# Altium schematic sheet External_boards.SchDoc
size A4; SheetNumber: 7; SheetTotal: 7
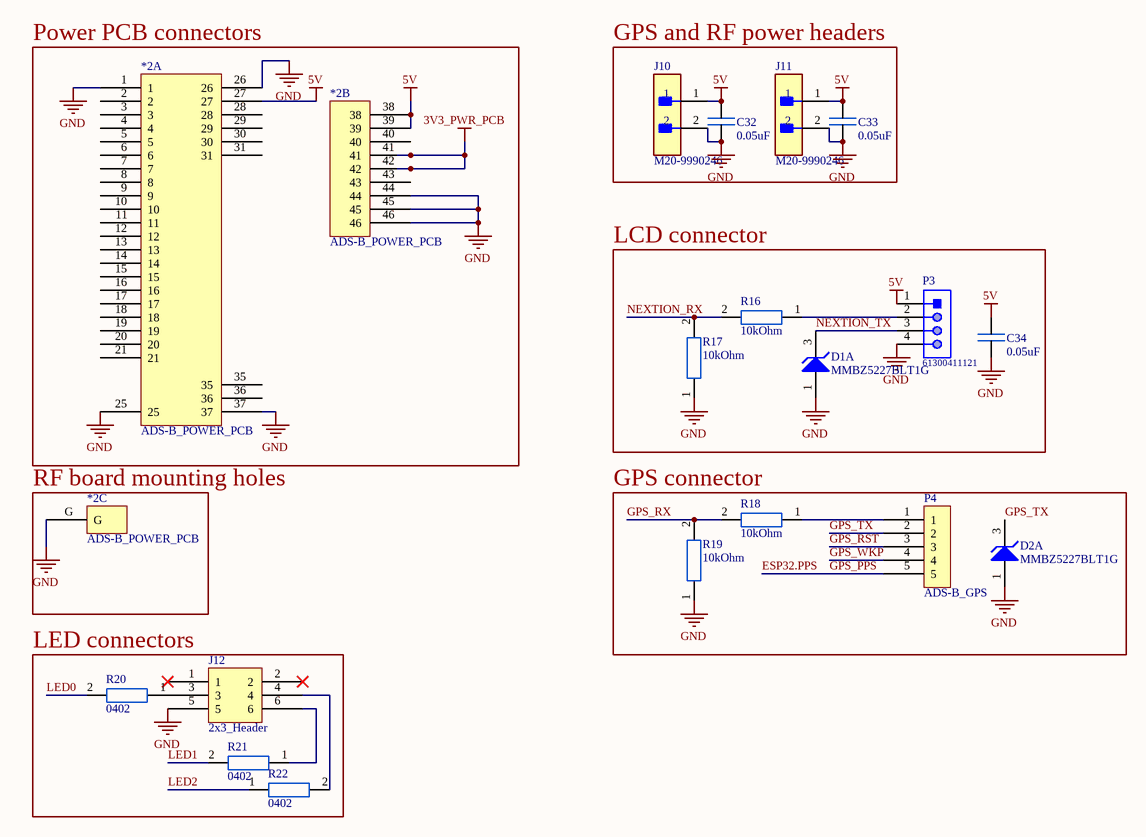
[diagram p0: External_boards.SchDoc]

## Parts
*2  ADS-B_POWER_PCB  [ADS-B_POWER_PCB]  (parts A,B,C of 3)
C32  0.05uF  [0402_footprint]
C33  0.05uF  [0402_footprint]
C34  0.05uF  [0402_footprint]
D1  MMBZ5227BLT1G  [ONSC-SOT-23-3-318-08_V]  (part A of 2)
D2  MMBZ5227BLT1G  [ONSC-SOT-23-3-318-08_V]  (part A of 2)
J10  M20-9990246  [FP-M20-9990246-MFG]
J11  M20-9990246  [FP-M20-9990246-MFG]
J12  2x3_Header  [2x3 header]
P3  61300411121  [61300411121]
P4  ADS-B_GPS  [ADS-B_GPS]
R16  10kOhm  [0402_footprint]
R17  10kOhm  [0402_footprint]
R18  10kOhm  [0402_footprint]
R19  10kOhm  [0402_footprint]
R20  0402  [0402_footprint]
R21  0402  [0402_footprint]
R22  0402  [0402_footprint]

## Blocks framed on the sheet
Power PCB connectors: *2
GPS and RF power headers: C32 C33 J10 J11
LCD connector: C34 D1 P3 R16 R17
RF board mounting holes: *2
GPS connector: D2 P4 R18 R19
LED connectors: J12 R20-R22

## Nets
3V3_PWR_PCB: *2.41 *2.42
5V: *2.27 *2.38 *2.39 C32.2 C33.2 C34.2 J10.1 J11.1 P3.1
GND: *2.1 *2.25 *2.26 *2.37 *2.44 *2.45 *2.46 *2.G C32.1 C33.1 C34.1 D1.1(A) D2.1(A) J10.2 J11.2 J12.5 P3.4 R17.1 R19.1
ESP32.PPS: P4.5  [also labelled GPS_PPS]
GPS_RST: P4.3
GPS_RX: R18.2 R19.2
GPS_TX: D2.3(K) P4.2
GPS_WKP: P4.4
LED0: R20.2
LED1: R21.2
LED2: R22.1
NEXTION_RX: R16.2 R17.2
NEXTION_TX: D1.3(K) P3.3
NetJ12_3: J12.3 R20.1
NetJ12_4: J12.4 R22.2
NetJ12_6: J12.6 R21.1
NetP3_2: P3.2 R16.1
NetP4_1: P4.1 R18.1

Not connected (* = marked no-connect by the designer): *2 2 3 4 5 6 7 8 9 10 11 12 13 14 15 16 17 18 19 20 21 28 29 30 31 35 36 40 43; J12 1* 2*

## Library data of the parts
C32-C34 = Capacitor_0402: 0402 capacitor
D1 D2 = CMP-1060-00983-1: Zener Voltage Regulator, 225 mW, 3-Pin SOT-23, Pb-Free, Tape and Reel; Manufacturer: On Semiconductor; VZ Typ (V): 3.6; ComponentLink1URL: http://www.onsemi.com/; ComponentLink1Description: Manufacturer URL; ComponentLink3Description: Package Specification; PackageDescription: 3-Pin Small Outline Transistor, Body 2.92 x 1.3 mm, Pitch 0.95 mm; RoHS: Pb-Free; PackageReference: SOT-23-3-318-08; Packing: Tape and Reel; PackageVersion: Rev. AP, 11/2009; PartNumber: MMBZ5227BLT1G; ComponentLink2Description: Datasheet; ComponentLink2URL: http://www.onsemi.cn/pub_link/Collateral/MMBZ5221BLT1-D.PDF; DatasheetVersion: Rev. 12; ComponentLink3URL: http://www.onsemi.cn/pub_link/Collateral/318-08.PDF; Mounting Technology: Surface Mount; ComponentLink4Description: Buy; ComponentLink4URL: https://www.mouser.lt/ProductDetail/onsemi/MMBZ5227BLT1G?qs=P4IOph%252Bbot%252Bc24HkQGoTVg%3D%3D
J10 J11 = CMP-15831-000009-1: CONN HEADER VERT 2POS 2.54MM; Manufacturer: Harwin; Conn Gender: Male; Conn Orientation: Vertical; Number Of Contacts: 2; Current Rating: 3A; ComponentLink2URL: https://cdn.harwin.com/pdfs/M20-999.pdf; ComponentLink2Description: Datasheet; Package: M20-9990246; Temperature: -40°C to +105°C; Octopart: https://octopart.com/m20-9990246-harwin-2590635; Mouser Description: 2.54mm (0.1") Pitch SIL Vertical PC Tail Pin Header, 6.1mm mating pin height, tin, 2 contacts; Temperature Range High: +105°C; Device Class L1: Connectors; RoHS: TRUE; Automotive: No; Height: 8.99mm; Number Of Rows: 1; Contact Material: Tin,Nickel; Category: Conn; Pitch: 2.54mm; Lead Free: Yes; Digikey Description: CONN HEADER VERT 2POS 2.54MM; Manufacturer Part Number: M20-9990246; Temperature Range Low: -40°C; Device Class L3: unset; Device Class L2: Headers and Wire Housings
P3 = CMP-1502-01064-1: THT Vertical Pin Header WR-PHD, Pitch 2.54 mm, Single Row, 4 pins; Manufacturer: Wurth Elektronik; Withstanding Voltage: 500VAC; Rated Current: 3A; Working Voltage: 250VAC; Pin Number: 4; Gender: Male; Contact Resistance: 20mOhm; Pitch: 2.54mm; Manufacturer URL: http://www.we-online.de; Operating Temperature: -40to105degC; Packaging: Bag; Mounting Technology: THT; Package Reference: 61300411121; Datasheet URL: https://katalog.we-online.de/em/datasheet/6130xx11121.pdf; Publisher: WurthElektronik; Part Number: 61300411121; Row Number: Single; Orientation: Vertical
R16-R22 = Resistor_0402: 0402 resistor